# Altium schematic sheet Espectrometro_Micro.SchDoc
size A4
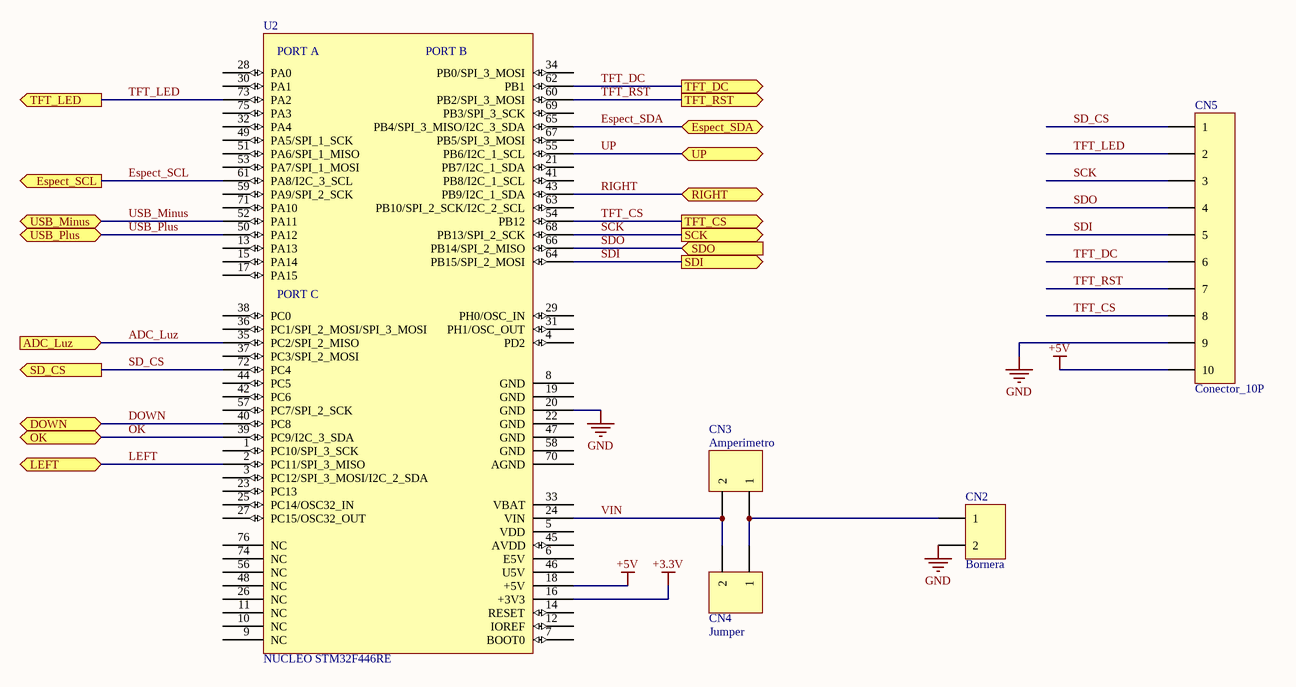
[diagram p0: Espectrometro_Micro.SchDoc]

## Parts
CN2  Bornera  [TERMINAL BLOCK DG306 - D5mm - 02P]
CN3  Amperimetro  [TERMINAL BLOCK DG306 - D5mm - 02P]
CN4  Jumper  [HEADER_M-2x1_0.1"_V]
CN5  Conector_10P  [HEADER_M-10x2_0.1"_V]
U2  NUCLEO STM32F446RE  [NUCLEO - STM32F446RE - UP]

## Ports
ADC_Luz (in), DOWN (bidir), Espect_SCL (out), Espect_SDA (bidir), LEFT (bidir), OK (bidir), RIGHT (bidir), SCK (out), SD_CS (out), SDI (out), SDO (in), TFT_CS (out), TFT_DC (out), TFT_LED (out), TFT_RST (out), UP (bidir), USB_Minus (bidir), USB_Plus (bidir)

## Nets
+3.3V: U2.16(+3V3)
+5V: CN5.10 U2.18(+5V)
GND: CN2.2 CN5.9 U2.20(GND)
ADC_Luz: U2.35(PC2/SPI_2_MISO) ; port ADC_Luz
DOWN: U2.40(PC8) ; port DOWN
Espect_SCL: U2.61(PA8/I2C_3_SCL) ; port Espect_SCL
Espect_SDA: U2.65(PB4/SPI_3_MISO/I2C_3_SDA) ; port Espect_SDA
LEFT: U2.2(PC11/SPI_3_MISO) ; port LEFT
OK: U2.39(PC9/I2C_3_SDA) ; port OK
RIGHT: U2.43(PB9/I2C_1_SDA) ; port RIGHT
SCK: CN5.3 U2.68(PB13/SPI_2_SCK) ; port SCK
SD_CS: CN5.1 U2.72(PC4) ; port SD_CS
SDI: CN5.5 U2.64(PB15/SPI_2_MOSI) ; port SDI
SDO: CN5.4 U2.66(PB14/SPI_2_MISO) ; port SDO
TFT_CS: CN5.8 U2.54(PB12) ; port TFT_CS
TFT_DC: CN5.6 U2.62(PB1) ; port TFT_DC
TFT_LED: CN5.2 U2.73(PA2) ; port TFT_LED
TFT_RST: CN5.7 U2.60(PB2/SPI_3_MOSI) ; port TFT_RST
UP: U2.55(PB6/I2C_1_SCL) ; port UP
USB_Minus: U2.52(PA11) ; port USB_Minus
USB_Plus: U2.50(PA12) ; port USB_Plus
VIN: CN3.2 CN4.2 U2.24(VIN)
NetCN2_1: CN2.1 CN3.1 CN4.1

Not connected (* = marked no-connect by the designer): U2 1(PC10/SPI_3_SCK) 3(PC12/SPI_3_MOSI/I2C_2_SDA) 4(PD2) 5(VDD) 6(E5V) 7(BOOT0) 8(GND) 9(NC) 10(NC) 11(NC) 12(IOREF) 13(PA13) 14(RESET) 15(PA14) 17(PA15) 19(GND) 21(PB7/I2C_1_SDA) 22(GND) 23(PC13) 25(PC14/OSC32_IN) 26(NC) 27(PC15/OSC32_OUT) 28(PA0) 29(PH0/OSC_IN) 30(PA1) 31(PH1/OSC_OUT) 32(PA4) 33(VBAT) 34(PB0/SPI_3_MOSI) 36(PC1/SPI_2_MOSI/SPI_3_MOSI) 37(PC3/SPI_2_MOSI) 38(PC0) 41(PB8/I2C_1_SCL) 42(PC6) 44(PC5) 45(AVDD) 46(U5V) 47(GND) 48(NC) 49(PA5/SPI_1_SCK) 51(PA6/SPI_1_MISO) 53(PA7/SPI_1_MOSI) 56(NC) 57(PC7/SPI_2_SCK) 58(GND) 59(PA9/SPI_2_SCK) 63(PB10/SPI_2_SCK/I2C_2_SCL) 67(PB5/SPI_3_MOSI) 69(PB3/SPI_3_SCK) 70(AGND) 71(PA10) 74(NC) 75(PA3) 76(NC)

## Notes on the sheet
- (in symbol NUCLEO STM32F446RE) PORT A; PORT B; PORT C

## Library data of the parts
CN2 = Conector_2P: Conector 2 Vias
CN3 = Conector_2P_Amp: Conector 2 Vias
CN4 = Conector_2P
CN5 = Conector_10P: Conector 10 Vias